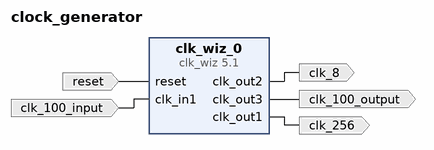
[diagram p0: block diagram of the top level]
# Vivado block design clock_generator, Vivado 2015.2
create_bd_design clock_generator

create_bd_port -dir I -type rst reset
set_property -dict {CONFIG.POLARITY ACTIVE_HIGH} [get_bd_ports reset]
create_bd_port -dir O -type clk clk_100_output
create_bd_port -dir I -type clk clk_100_input
create_bd_port -dir O -type clk clk_256
create_bd_port -dir O -type clk clk_8

create_bd_cell -type ip -vlnv xilinx.com:ip:clk_wiz:5.1 clk_wiz_0
set_property -dict [list \
  CONFIG.CLKOUT2_USED true \
  CONFIG.CLKOUT3_USED true \
  CONFIG.NUM_OUT_CLKS 3 \
  CONFIG.CLKOUT1_REQUESTED_OUT_FREQ 256 \
  CONFIG.CLKOUT2_REQUESTED_OUT_FREQ 8.398 \
  CONFIG.USE_LOCKED false \
  CONFIG.MMCM_DIVCLK_DIVIDE 1 \
  CONFIG.MMCM_CLKFBOUT_MULT_F 8.000 \
  CONFIG.MMCM_CLKOUT0_DIVIDE_F 3.125 \
  CONFIG.MMCM_CLKOUT1_DIVIDE 95 \
  CONFIG.MMCM_CLKOUT2_DIVIDE 8 \
  CONFIG.CLKOUT1_JITTER 120.767 \
  CONFIG.CLKOUT1_PHASE_ERROR 114.212 \
  CONFIG.CLKOUT2_JITTER 237.135 \
  CONFIG.CLKOUT2_PHASE_ERROR 114.212 \
  CONFIG.CLKOUT3_JITTER 144.719 \
  CONFIG.CLKOUT3_PHASE_ERROR 114.212 \
] [get_bd_cells clk_wiz_0]

# ---- connections ----

connect_bd_net [get_bd_ports reset] [get_bd_pins clk_wiz_0/reset]
connect_bd_net [get_bd_pins clk_wiz_0/clk_out3] [get_bd_ports clk_100_output]
connect_bd_net [get_bd_ports clk_100_input] [get_bd_pins clk_wiz_0/clk_in1]
connect_bd_net [get_bd_pins clk_wiz_0/clk_out1] [get_bd_ports clk_256]
connect_bd_net [get_bd_pins clk_wiz_0/clk_out2] [get_bd_ports clk_8]

validate_bd_design
save_bd_design
